# EAGLE schematic Dist_board_(1.21) (EAGLE 7.5.0)
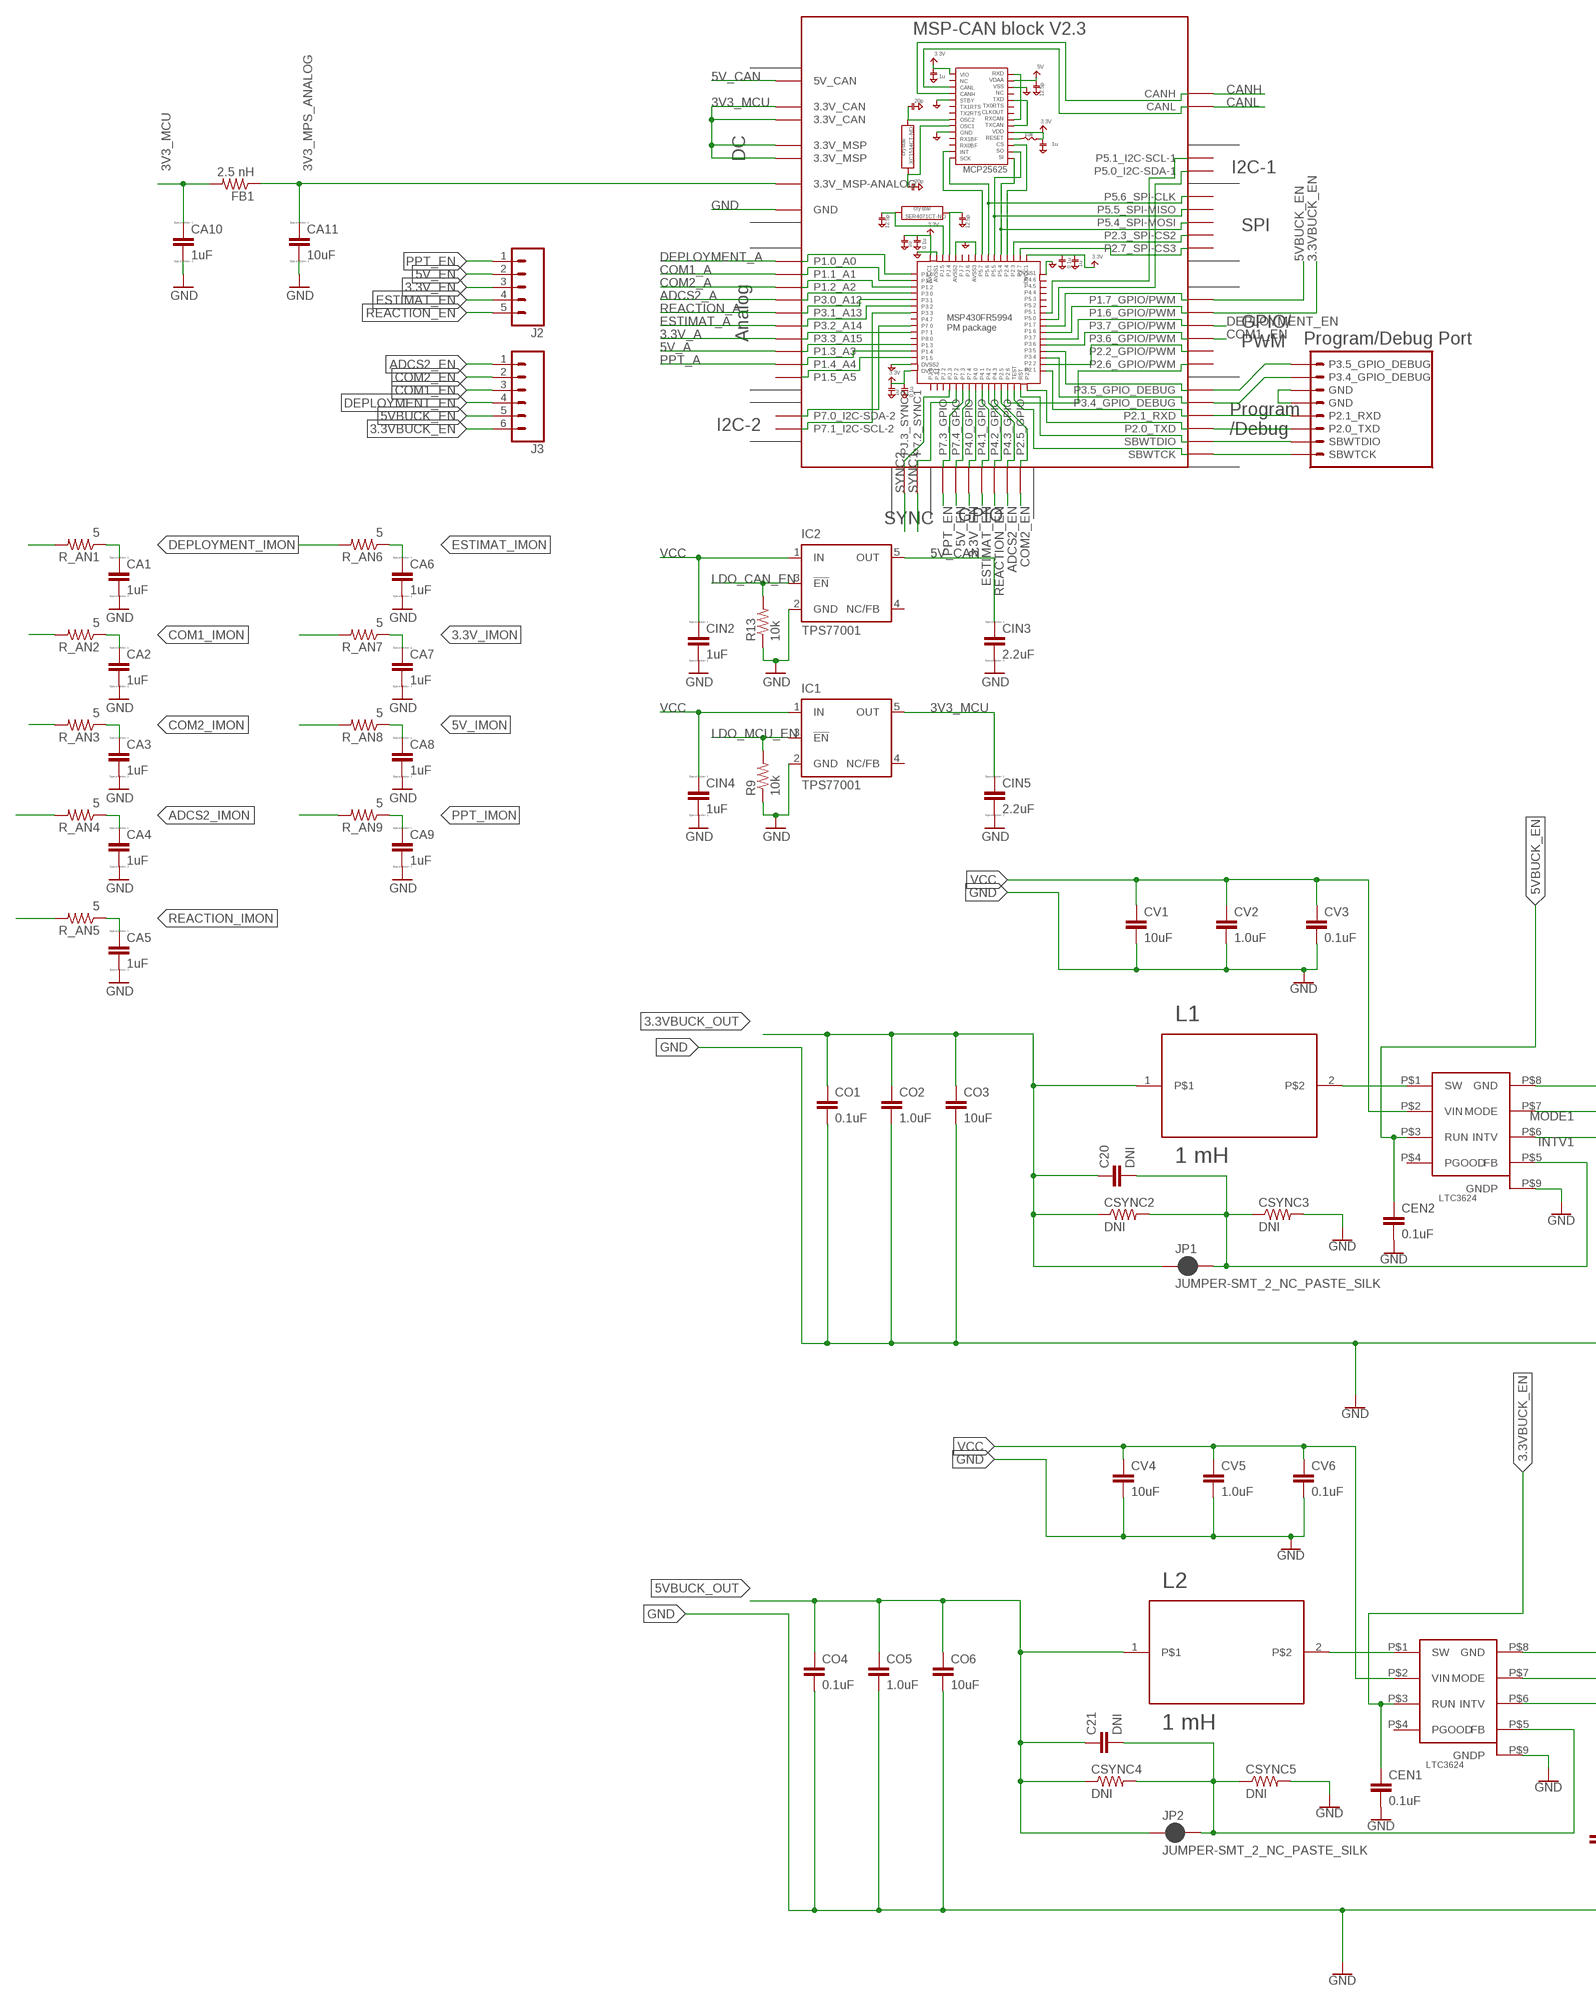
[diagram p0: schematic, sheet 1, part 1 of 3]
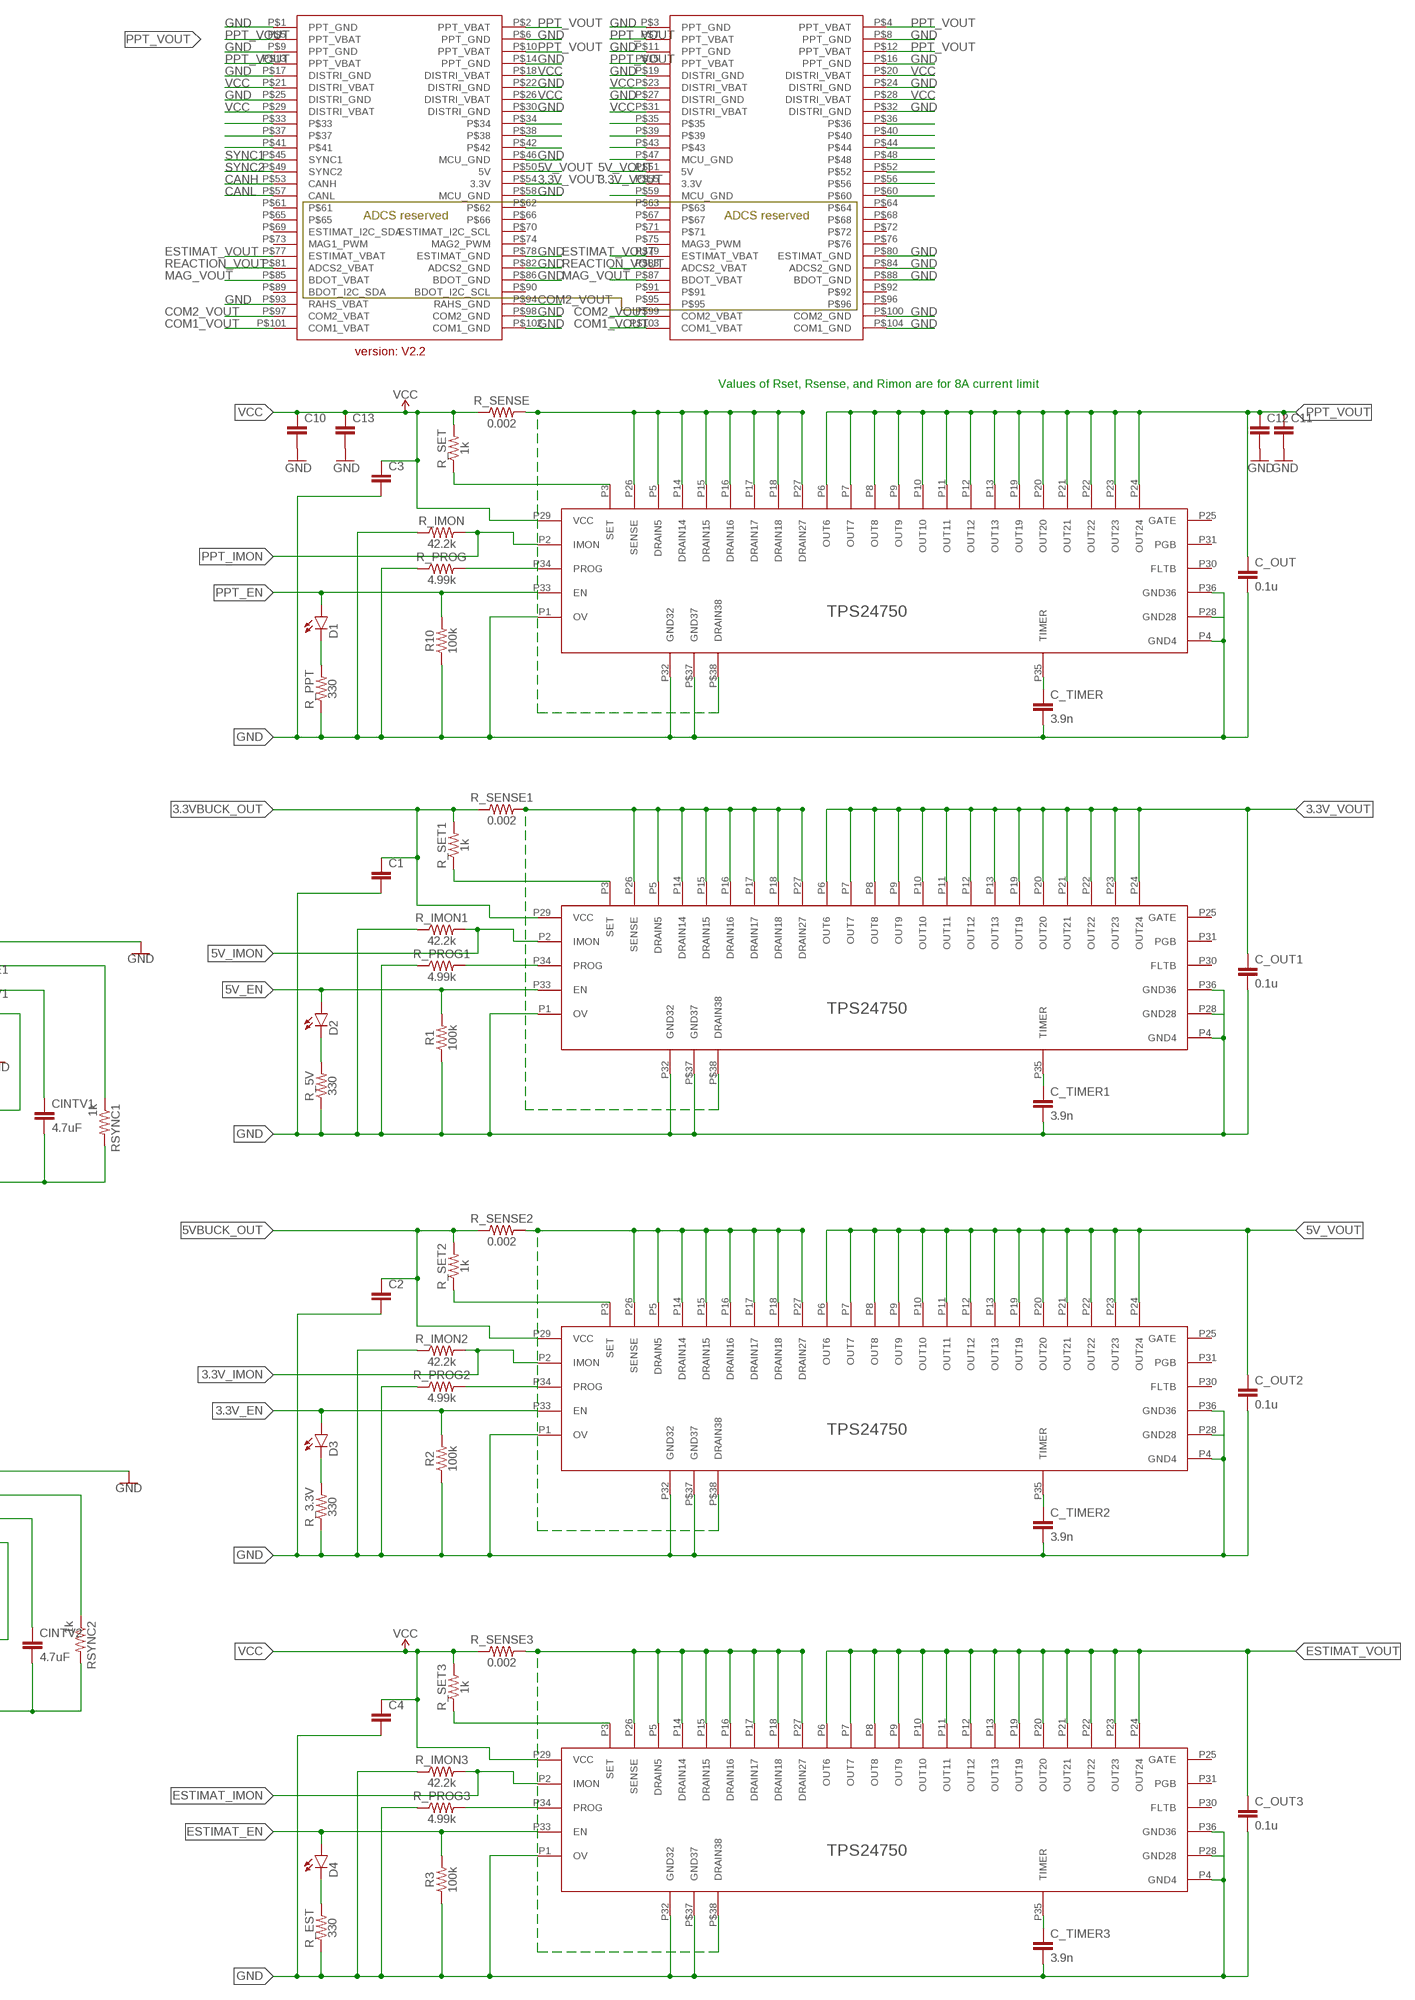
[diagram p1: schematic, sheet 1, part 2 of 3]
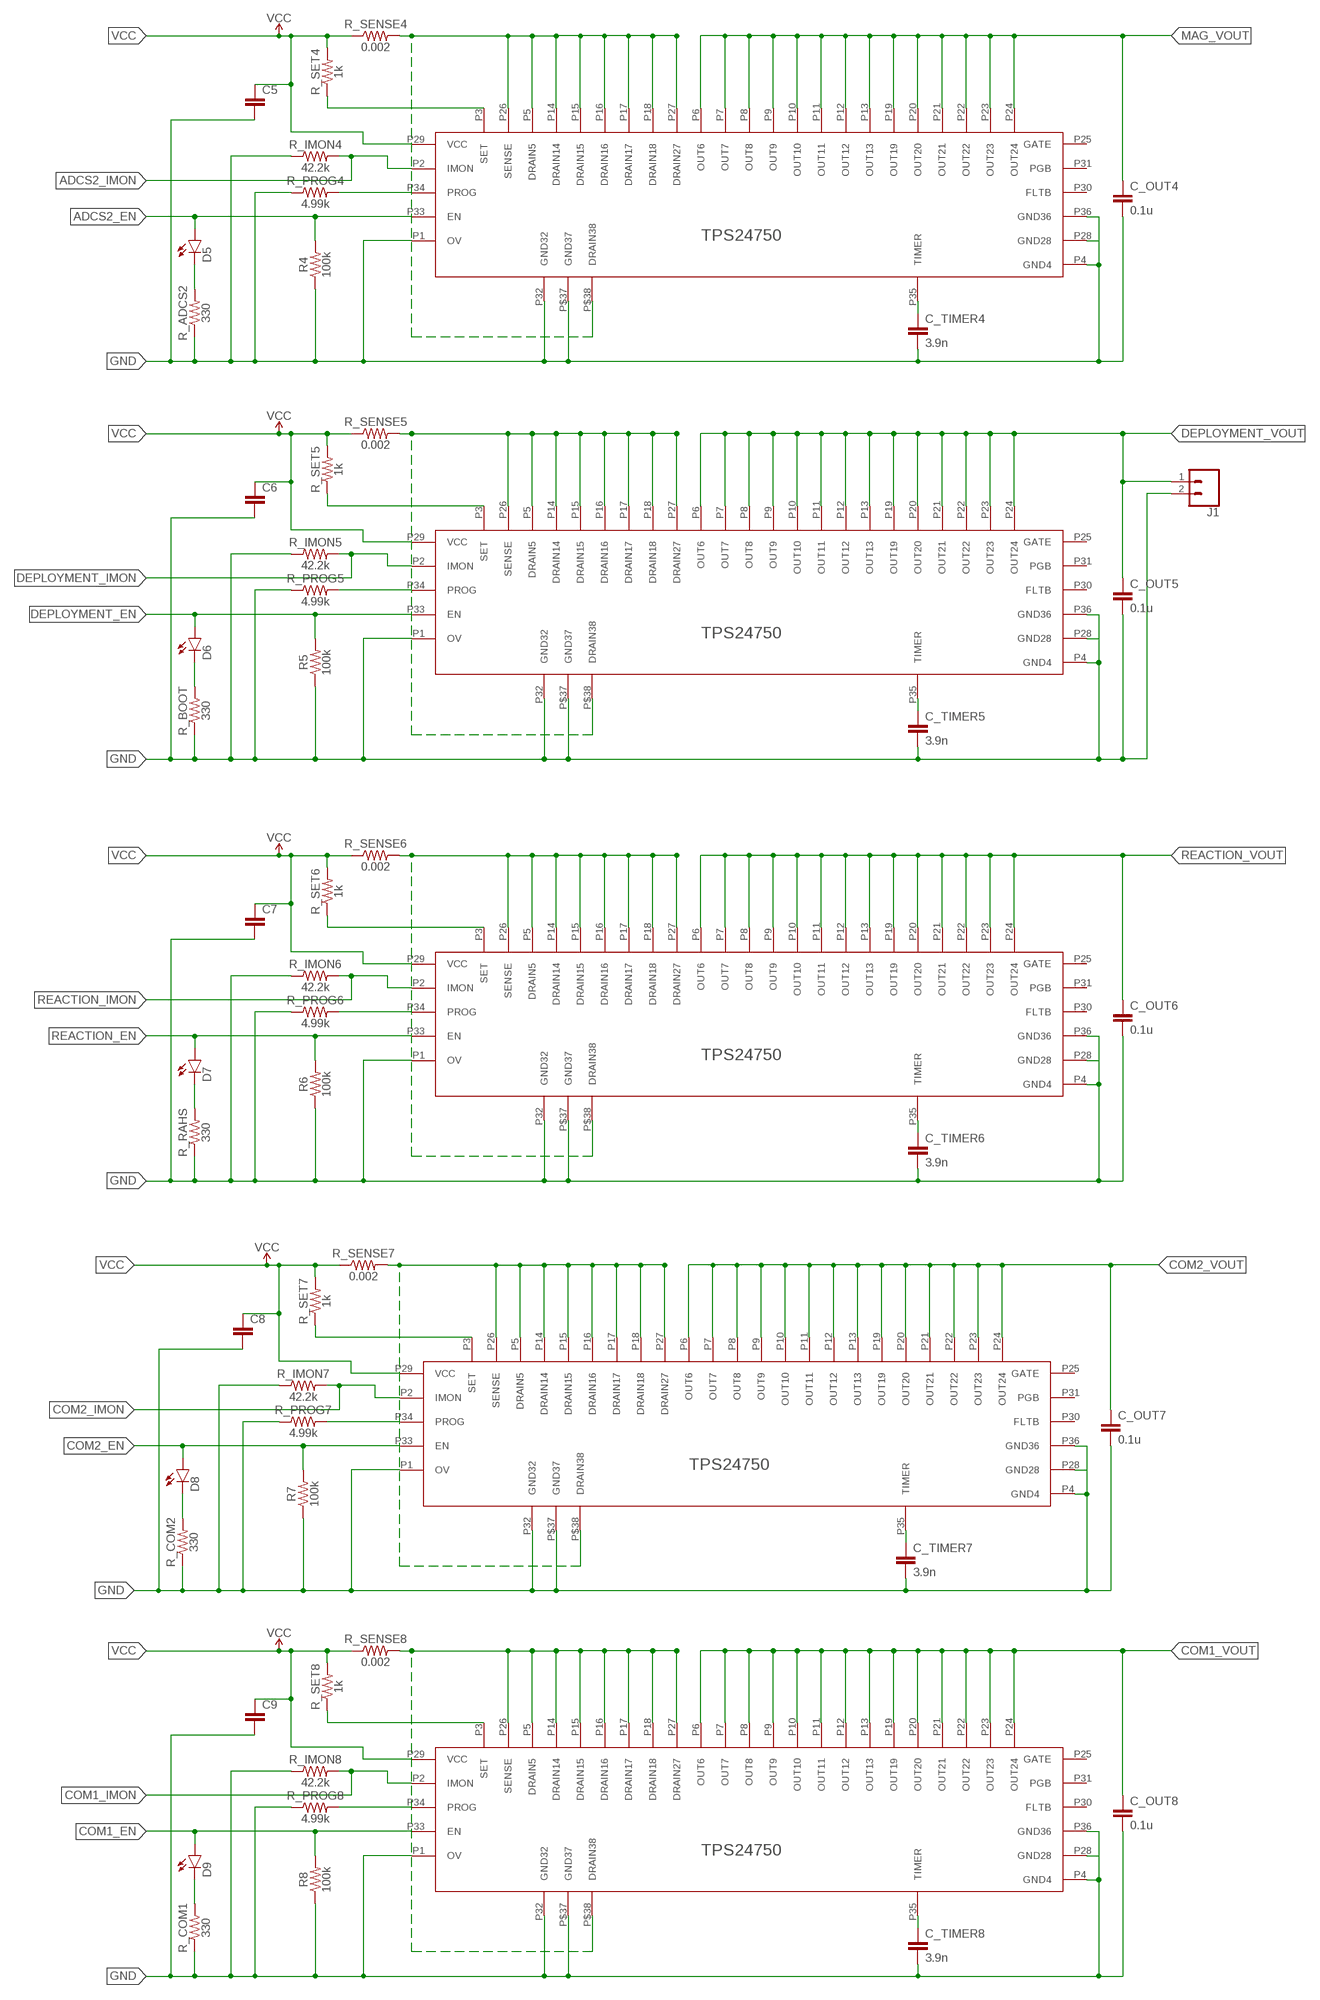
[diagram p2: schematic, sheet 1, part 3 of 3]

## Parts
C1  GEN_CAP_0805SMD  [0805]
C2  GEN_CAP_0805SMD  [0805]
C3  GEN_CAP_0805SMD  [0805]
C4  GEN_CAP_0805SMD  [0805]
C5  GEN_CAP_0805SMD  [0805]
C6  GEN_CAP_0805SMD  [0805]
C7  GEN_CAP_0805SMD  [0805]
C8  GEN_CAP_0805SMD  [0805]
C9  GEN_CAP_0805SMD  [0805]
C10  GEN_CAP_0805SMD  [0805]
C11  GEN_CAP_0805SMD  [0805]
C12  GEN_CAP_0805SMD  [0805]
C13  GEN_CAP_0805SMD  [0805]
C20  DNI  1.0UF-0805-25V-(+80/-20%)  [0805]
C21  DNI  1.0UF-0805-25V-(+80/-20%)  [0805]
C_OUT  0.1u  GEN_CAP_0805SMD  [0805]
C_OUT1  0.1u  GEN_CAP_0805SMD  [0805]
C_OUT2  0.1u  GEN_CAP_0805SMD  [0805]
C_OUT3  0.1u  GEN_CAP_0805SMD  [0805]
C_OUT4  0.1u  GEN_CAP_0805SMD  [0805]
C_OUT5  0.1u  GEN_CAP_0805SMD  [0805]
C_OUT6  0.1u  GEN_CAP_0805SMD  [0805]
C_OUT7  0.1u  GEN_CAP_0805SMD  [0805]
C_OUT8  0.1u  GEN_CAP_0805SMD  [0805]
C_TIMER  3.9n  GEN_CAP_0805SMD  [0805]
C_TIMER1  3.9n  GEN_CAP_0805SMD  [0805]
C_TIMER2  3.9n  GEN_CAP_0805SMD  [0805]
C_TIMER3  3.9n  GEN_CAP_0805SMD  [0805]
C_TIMER4  3.9n  GEN_CAP_0805SMD  [0805]
C_TIMER5  3.9n  GEN_CAP_0805SMD  [0805]
C_TIMER6  3.9n  GEN_CAP_0805SMD  [0805]
C_TIMER7  3.9n  GEN_CAP_0805SMD  [0805]
C_TIMER8  3.9n  GEN_CAP_0805SMD  [0805]
CA1  1uF  C  [C0805]
CA2  1uF  C  [C0805]
CA3  1uF  C  [C0805]
CA4  1uF  C  [C0805]
CA5  1uF  C  [C0805]
CA6  1uF  C  [C0805]
CA7  1uF  C  [C0805]
CA8  1uF  C  [C0805]
CA9  1uF  C  [C0805]
CA10  1uF  C  [C0805]
CA11  10uF  C  [C0805]
CEN1  0.1uF  2.2UF-0805-25V-(+80/-20%)  [0805]
CEN2  0.1uF  2.2UF-0805-25V-(+80/-20%)  [0805]
CIN2  1uF  C  [C0805]
CIN3  2.2uF  C  [C0805]
CIN4  1uF  C  [C0805]
CIN5  2.2uF  C  [C0805]
CINTV1  4.7uF  2.2UF-0805-25V-(+80/-20%)  [0805]
CINTV2  4.7uF  2.2UF-0805-25V-(+80/-20%)  [0805]
CO1  0.1uF  1.0UF-0805-25V-(+80/-20%)  [0805]
CO2  1.0uF  1.0UF-0805-25V-(+80/-20%)  [0805]
CO3  10uF  10UF-0805-10V-10%  [0805]
CO4  0.1uF  1.0UF-0805-25V-(+80/-20%)  [0805]
CO5  1.0uF  1.0UF-0805-25V-(+80/-20%)  [0805]
CO6  10uF  10UF-0805-10V-10%  [0805]
CSYNC2  DNI  R-US_R0805  [R0805]
CSYNC3  DNI  R-US_R0805  [R0805]
CSYNC4  DNI  R-US_R0805  [R0805]
CSYNC5  DNI  R-US_R0805  [R0805]
CV1  10uF  1.0UF-0805-25V-10%  [0805]
CV2  1.0uF  1.0UF-0805-25V-10%  [0805]
CV3  0.1uF  1.0UF-0805-25V-10%  [0805]
CV4  10uF  1.0UF-0805-25V-10%  [0805]
CV5  1.0uF  1.0UF-0805-25V-10%  [0805]
CV6  0.1uF  1.0UF-0805-25V-10%  [0805]
D1  LED  [LED-1206]
D2  LED  [LED-1206]
D3  LED  [LED-1206]
D4  LED  [LED-1206]
D5  LED  [LED-1206]
D6  LED  [LED-1206]
D7  LED  [LED-1206]
D8  LED  [LED-1206]
D9  LED  [LED-1206]
FB1  2.5 nH  R-US_R0805  [R0805]
IC1  TPS77001  [SOT23-DBV]
IC2  TPS77001  [SOT23-DBV]
J1  CONN_023.5MM  [SCREWTERMINAL-3.5MM-2]
J2  CONN_05LOCK  [1X05_LOCK]
J3  CONN_06LOCK  [1X06_LOCK]
JP1  JUMPER-SMT_2_NC_PASTE_SILK  [SMT-JUMPER_2_NC_PASTE_SILK]
JP2  JUMPER-SMT_2_NC_PASTE_SILK  [SMT-JUMPER_2_NC_PASTE_SILK]
L1  1 mH  XAL4030-332ME  [COILCRAFT]
L2  1 mH  XAL4030-332ME  [COILCRAFT]
R1  100k  GEN_RES_0805SMD  [0805]
R2  100k  GEN_RES_0805SMD  [0805]
R3  100k  GEN_RES_0805SMD  [0805]
R4  100k  GEN_RES_0805SMD  [0805]
R5  100k  GEN_RES_0805SMD  [0805]
R6  100k  GEN_RES_0805SMD  [0805]
R7  100k  GEN_RES_0805SMD  [0805]
R8  100k  GEN_RES_0805SMD  [0805]
R9  10k  R-US_R0805  [R0805]
R10  100k  GEN_RES_0805SMD  [0805]
R13  10k  R-US_R0805  [R0805]
R_3.3V  330  GEN_RES_0805SMD  [0805]
R_5V  330  GEN_RES_0805SMD  [0805]
R_ADCS2  330  GEN_RES_0805SMD  [0805]
R_AN1  5  R-US_R0805  [R0805]
R_AN2  5  R-US_R0805  [R0805]
R_AN3  5  R-US_R0805  [R0805]
R_AN4  5  R-US_R0805  [R0805]
R_AN5  5  R-US_R0805  [R0805]
R_AN6  5  R-US_R0805  [R0805]
R_AN7  5  R-US_R0805  [R0805]
R_AN8  5  R-US_R0805  [R0805]
R_AN9  5  R-US_R0805  [R0805]
R_BOOT  330  GEN_RES_0805SMD  [0805]
R_COM1  330  GEN_RES_0805SMD  [0805]
R_COM2  330  GEN_RES_0805SMD  [0805]
R_EST  330  GEN_RES_0805SMD  [0805]
R_IMON  42.2k  GEN_RES_0805SMD  [0805]
R_IMON1  42.2k  GEN_RES_0805SMD  [0805]
R_IMON2  42.2k  GEN_RES_0805SMD  [0805]
R_IMON3  42.2k  GEN_RES_0805SMD  [0805]
R_IMON4  42.2k  GEN_RES_0805SMD  [0805]
R_IMON5  42.2k  GEN_RES_0805SMD  [0805]
R_IMON6  42.2k  GEN_RES_0805SMD  [0805]
R_IMON7  42.2k  GEN_RES_0805SMD  [0805]
R_IMON8  42.2k  GEN_RES_0805SMD  [0805]
R_PPT  330  GEN_RES_0805SMD  [0805]
R_PROG  4.99k  GEN_RES_0805SMD  [0805]
R_PROG1  4.99k  GEN_RES_0805SMD  [0805]
R_PROG2  4.99k  GEN_RES_0805SMD  [0805]
R_PROG3  4.99k  GEN_RES_0805SMD  [0805]
R_PROG4  4.99k  GEN_RES_0805SMD  [0805]
R_PROG5  4.99k  GEN_RES_0805SMD  [0805]
R_PROG6  4.99k  GEN_RES_0805SMD  [0805]
R_PROG7  4.99k  GEN_RES_0805SMD  [0805]
R_PROG8  4.99k  GEN_RES_0805SMD  [0805]
R_RAHS  330  GEN_RES_0805SMD  [0805]
R_SENSE  0.002  GEN_RES_2010SMD  [2010]
R_SENSE1  0.002  GEN_RES_2010SMD  [2010]
R_SENSE2  0.002  GEN_RES_2010SMD  [2010]
R_SENSE3  0.002  GEN_RES_2010SMD  [2010]
R_SENSE4  0.002  GEN_RES_2010SMD  [2010]
R_SENSE5  0.002  GEN_RES_2010SMD  [2010]
R_SENSE6  0.002  GEN_RES_2010SMD  [2010]
R_SENSE7  0.002  GEN_RES_2010SMD  [2010]
R_SENSE8  0.002  GEN_RES_2010SMD  [2010]
R_SET  1k  GEN_RES_0805SMD  [0805]
R_SET1  1k  GEN_RES_0805SMD  [0805]
R_SET2  1k  GEN_RES_0805SMD  [0805]
R_SET3  1k  GEN_RES_0805SMD  [0805]
R_SET4  1k  GEN_RES_0805SMD  [0805]
R_SET5  1k  GEN_RES_0805SMD  [0805]
R_SET6  1k  GEN_RES_0805SMD  [0805]
R_SET7  1k  GEN_RES_0805SMD  [0805]
R_SET8  1k  GEN_RES_0805SMD  [0805]
RSYNC1  1k  R-US_R0805  [R0805]
RSYNC2  1k  R-US_R0805  [R0805]
U$1  TI_SWITCH_TPS24750  [QFN-36]
U$2  PC104_CONNECTOR  [PC104_CONNECTOR]
U$5  TI_SWITCH_TPS24750  [QFN-36]
U$6  TI_SWITCH_TPS24750  [QFN-36]
U$7  TI_SWITCH_TPS24750  [QFN-36]
U$8  TI_SWITCH_TPS24750  [QFN-36]
U$9  TI_SWITCH_TPS24750  [QFN-36]
U$10  TI_SWITCH_TPS24750  [QFN-36]
U$11  TI_SWITCH_TPS24750  [QFN-36]
U$12  TI_SWITCH_TPS24750  [QFN-36]
U$13  LINEAR_BUCK_LTC3624  [8-LFCSP]
U$14  LINEAR_BUCK_LTC3624  [8-LFCSP]
U$15  MSP-CAN_BLOCK  [MSP-CAN_BLOCK]
U$16  PROGRAM/DEBUG_PORT  [1X08_CONNECTOR]

## Nets
3.3V_A: CA7.1 R_AN7.1 U$15.P3.3_A15
3.3V_EN: D3.A J2.3 R2.2 U$6.P33(EN) U$15.P4.0_GPIO
3.3V_IMON: R_AN7.2 R_IMON2.2 U$6.P2(IMON)
3.3V_VOUT: C_OUT1.1 U$2.P$54(3.3V) U$2.P$55(3.3V) U$5.P6(OUT6) U$5.P7(OUT7) U$5.P8(OUT8) U$5.P9(OUT9) U$5.P10(OUT10) U$5.P11(OUT11) U$5.P12(OUT12) U$5.P13(OUT13) U$5.P19(OUT19) U$5.P20(OUT20) U$5.P21(OUT21) U$5.P22(OUT22) U$5.P23(OUT23) U$5.P24(OUT24)
3.3VBUCK_EN: CEN1.1 J3.6 U$14.P$3(RUN) U$15.P1.6_GPIO/PWM
3.3VBUCK_OUT: C1.1 C20.1 CO1.1 CO2.1 CO3.1 CSYNC2.1 JP1.1 L1.1 R_SENSE1.1 R_SET1.2 U$5.P29(VCC)
3V3_MCU: CA10.1 CIN5.1 FB1.2 IC1.5(OUT) U$15.3.3V@CAN1(3.3V_CAN) U$15.3.3V@CAN2(3.3V_CAN) U$15.3.3V@MSP1(3.3V_MSP) U$15.3.3V@MSP2(3.3V_MSP)
3V3_MPS_ANALOG: CA11.1 FB1.1 U$15.3.3V_ANALOG@MSP2(3.3V_MSP-ANALOG)
5V_A: CA8.1 R_AN8.1 U$15.P1.3_A3
5V_CAN: CIN3.1 IC2.5(OUT) U$15.5V(5V_CAN)
5V_EN: D2.A J2.2 R1.2 U$5.P33(EN) U$15.P7.4_GPIO
5V_IMON: R_AN8.2 R_IMON1.2 U$5.P2(IMON)
5V_VOUT: C_OUT2.1 U$2.P$50(5V) U$2.P$51(5V) U$6.P6(OUT6) U$6.P7(OUT7) U$6.P8(OUT8) U$6.P9(OUT9) U$6.P10(OUT10) U$6.P11(OUT11) U$6.P12(OUT12) U$6.P13(OUT13) U$6.P19(OUT19) U$6.P20(OUT20) U$6.P21(OUT21) U$6.P22(OUT22) U$6.P23(OUT23) U$6.P24(OUT24)
5VBUCK_EN: CEN2.1 J3.5 U$13.P$3(RUN) U$15.P1.7_GPIO/PWM
5VBUCK_OUT: C2.1 C21.1 CO4.1 CO5.1 CO6.1 CSYNC4.1 JP2.1 L2.1 R_SENSE2.1 R_SET2.2 U$6.P29(VCC)
ADCS2_A: CA4.1 R_AN4.1 U$15.P3.0_A12
ADCS2_EN: D5.A J3.1 R4.2 U$8.P33(EN) U$15.P4.3_GPIO
ADCS2_IMON: R_AN4.2 R_IMON4.2 U$8.P2(IMON)
CAN_FB: C20.2 CSYNC2.2 CSYNC3.1 JP1.2 U$13.P$5(FB)
CANH: U$2.P$53(CANH) U$15.CANH
CANL: U$2.P$57(CANL) U$15.CANL
COM1_A: CA2.1 R_AN2.1 U$15.P1.1_A1
COM1_EN: D9.A J3.3 R8.2 U$12.P33(EN) U$15.P3.6_GPIO/PWM
COM1_IMON: R_AN2.2 R_IMON8.2 U$12.P2(IMON)
COM1_VOUT: C_OUT8.1 U$2.P$101(COM1_VBAT) U$2.P$103(COM1_VBAT) U$12.P6(OUT6) U$12.P7(OUT7) U$12.P8(OUT8) U$12.P9(OUT9) U$12.P10(OUT10) U$12.P11(OUT11) U$12.P12(OUT12) U$12.P13(OUT13) U$12.P19(OUT19) U$12.P20(OUT20) U$12.P21(OUT21) U$12.P22(OUT22) U$12.P23(OUT23) U$12.P24(OUT24)
COM2_A: CA3.1 R_AN3.1 U$15.P1.2_A2
COM2_EN: D8.A J3.2 R7.2 U$11.P33(EN) U$15.P2.5_GPIO
COM2_IMON: R_AN3.2 R_IMON7.2 U$11.P2(IMON)
COM2_VOUT: C_OUT7.1 U$2.P$94(RAHS_GND) U$2.P$97(COM2_VBAT) U$2.P$99(COM2_VBAT) U$11.P6(OUT6) U$11.P7(OUT7) U$11.P8(OUT8) U$11.P9(OUT9) U$11.P10(OUT10) U$11.P11(OUT11) U$11.P12(OUT12) U$11.P13(OUT13) U$11.P19(OUT19) U$11.P20(OUT20) U$11.P21(OUT21) U$11.P22(OUT22) U$11.P23(OUT23) U$11.P24(OUT24)
DEPLOYMENT_A: CA1.1 R_AN1.1 U$15.P1.0_A0
DEPLOYMENT_EN: D6.A J3.4 R5.2 U$9.P33(EN) U$15.P3.7_GPIO/PWM
DEPLOYMENT_IMON: R_AN1.2 R_IMON5.2 U$9.P2(IMON)
DEPLOYMENT_VOUT: C_OUT5.1 J1.1 U$9.P6(OUT6) U$9.P7(OUT7) U$9.P8(OUT8) U$9.P9(OUT9) U$9.P10(OUT10) U$9.P11(OUT11) U$9.P12(OUT12) U$9.P13(OUT13) U$9.P19(OUT19) U$9.P20(OUT20) U$9.P21(OUT21) U$9.P22(OUT22) U$9.P23(OUT23) U$9.P24(OUT24)
DRAIN: R_SENSE.2 U$1.P5(DRAIN5) U$1.P14(DRAIN14) U$1.P15(DRAIN15) U$1.P16(DRAIN16) U$1.P17(DRAIN17) U$1.P18(DRAIN18) U$1.P26(SENSE) U$1.P27(DRAIN27) U$1.P$38(DRAIN38)
DRAIN1: R_SENSE1.2 U$5.P5(DRAIN5) U$5.P14(DRAIN14) U$5.P15(DRAIN15) U$5.P16(DRAIN16) U$5.P17(DRAIN17) U$5.P18(DRAIN18) U$5.P26(SENSE) U$5.P27(DRAIN27) U$5.P$38(DRAIN38)
DRAIN2: R_SENSE2.2 U$6.P5(DRAIN5) U$6.P14(DRAIN14) U$6.P15(DRAIN15) U$6.P16(DRAIN16) U$6.P17(DRAIN17) U$6.P18(DRAIN18) U$6.P26(SENSE) U$6.P27(DRAIN27) U$6.P$38(DRAIN38)
DRAIN3: R_SENSE3.2 U$7.P5(DRAIN5) U$7.P14(DRAIN14) U$7.P15(DRAIN15) U$7.P16(DRAIN16) U$7.P17(DRAIN17) U$7.P18(DRAIN18) U$7.P26(SENSE) U$7.P27(DRAIN27) U$7.P$38(DRAIN38)
DRAIN4: R_SENSE4.2 U$8.P5(DRAIN5) U$8.P14(DRAIN14) U$8.P15(DRAIN15) U$8.P16(DRAIN16) U$8.P17(DRAIN17) U$8.P18(DRAIN18) U$8.P26(SENSE) U$8.P27(DRAIN27) U$8.P$38(DRAIN38)
DRAIN5: R_SENSE5.2 U$9.P5(DRAIN5) U$9.P14(DRAIN14) U$9.P15(DRAIN15) U$9.P16(DRAIN16) U$9.P17(DRAIN17) U$9.P18(DRAIN18) U$9.P26(SENSE) U$9.P27(DRAIN27) U$9.P$38(DRAIN38)
DRAIN6: R_SENSE6.2 U$10.P5(DRAIN5) U$10.P14(DRAIN14) U$10.P15(DRAIN15) U$10.P16(DRAIN16) U$10.P17(DRAIN17) U$10.P18(DRAIN18) U$10.P26(SENSE) U$10.P27(DRAIN27) U$10.P$38(DRAIN38)
DRAIN7: R_SENSE7.2 U$11.P5(DRAIN5) U$11.P14(DRAIN14) U$11.P15(DRAIN15) U$11.P16(DRAIN16) U$11.P17(DRAIN17) U$11.P18(DRAIN18) U$11.P26(SENSE) U$11.P27(DRAIN27) U$11.P$38(DRAIN38)
DRAIN8: R_SENSE8.2 U$12.P5(DRAIN5) U$12.P14(DRAIN14) U$12.P15(DRAIN15) U$12.P16(DRAIN16) U$12.P17(DRAIN17) U$12.P18(DRAIN18) U$12.P26(SENSE) U$12.P27(DRAIN27) U$12.P$38(DRAIN38)
ESTIMAT_A: CA6.1 R_AN6.1 U$15.P3.2_A14
ESTIMAT_EN: D4.A J2.4 R3.2 U$7.P33(EN) U$15.P4.1_GPIO
ESTIMAT_IMON: R_AN6.2 R_IMON3.2 U$7.P2(IMON)
ESTIMAT_VOUT: C_OUT3.1 U$2.P$77(ESTIMAT_VBAT) U$2.P$79(ESTIMAT_VBAT) U$7.P6(OUT6) U$7.P7(OUT7) U$7.P8(OUT8) U$7.P9(OUT9) U$7.P10(OUT10) U$7.P11(OUT11) U$7.P12(OUT12) U$7.P13(OUT13) U$7.P19(OUT19) U$7.P20(OUT20) U$7.P21(OUT21) U$7.P22(OUT22) U$7.P23(OUT23) U$7.P24(OUT24)
GND: C1.2 C2.2 C3.2 C4.2 C5.2 C6.2 C7.2 C8.2 C9.2 C10.2 C11.2 C12.2 C13.2 C_OUT1.2 C_OUT2.2 C_OUT3.2 C_OUT4.2 C_OUT5.2 C_OUT6.2 C_OUT7.2 C_OUT8.2 C_OUT.2 C_TIMER1.2 C_TIMER2.2 C_TIMER3.2 C_TIMER4.2 C_TIMER5.2 C_TIMER6.2 C_TIMER7.2 C_TIMER8.2 C_TIMER.2 CA1.2 CA2.2 CA3.2 CA4.2 CA5.2 CA6.2 CA7.2 CA8.2 CA9.2 CA10.2 CA11.2 CEN1.2 CEN2.2 CIN2.2 CIN3.2 CIN4.2 CIN5.2 CINTV1.2 CINTV2.2 CO1.2 CO2.2 CO3.2 CO4.2 CO5.2 CO6.2 CSYNC3.2 CSYNC5.2 CV1.2 CV2.2 CV3.2 CV4.2 CV5.2 CV6.2 IC1.2(GND) IC2.2(GND) J1.2 R1.1 R2.1 R3.1 R4.1 R5.1 R6.1 R7.1 R8.1 R9.1 R10.1 R13.1 R_3.3V.1 R_5V.1 R_ADCS2.1 R_BOOT.1 R_COM1.1 R_COM2.1 R_EST.1 R_IMON1.1 R_IMON2.1 R_IMON3.1 R_IMON4.1 R_IMON5.1 R_IMON6.1 R_IMON7.1 R_IMON8.1 R_IMON.1 R_PPT.1 R_PROG1.1 R_PROG2.1 R_PROG3.1 R_PROG4.1 R_PROG5.1 R_PROG6.1 R_PROG7.1 R_PROG8.1 R_PROG.1 R_RAHS.1 RSYNC1.2 RSYNC2.2 U$1.P1(OV) U$1.P4(GND4) U$1.P28(GND28) U$1.P32(GND32) U$1.P36(GND36) U$1.P$37(GND37) U$2.P$1(PPT_GND) U$2.P$3(PPT_GND) U$2.P$6(PPT_GND) U$2.P$8(PPT_GND) U$2.P$9(PPT_GND) U$2.P$11(PPT_GND) U$2.P$14(PPT_GND) U$2.P$16(PPT_GND) U$2.P$17(DISTRI_GND) U$2.P$19(DISTRI_GND) U$2.P$22(DISTRI_GND) U$2.P$24(DISTRI_GND) U$2.P$25(DISTRI_GND) U$2.P$27(DISTRI_GND) U$2.P$30(DISTRI_GND) U$2.P$32(DISTRI_GND) U$2.P$46(MCU_GND) U$2.P$47(MCU_GND) U$2.P$58(MCU_GND) U$2.P$59(MCU_GND) U$2.P$78(ESTIMAT_GND) U$2.P$80(ESTIMAT_GND) U$2.P$82(ADCS2_GND) U$2.P$84(ADCS2_GND) U$2.P$86(BDOT_GND) U$2.P$88(BDOT_GND) U$2.P$93(RAHS_VBAT) U$2.P$98(COM2_GND) U$2.P$100(COM2_GND) U$2.P$102(COM1_GND) U$2.P$104(COM1_GND) U$5.P1(OV) U$5.P4(GND4) U$5.P28(GND28) U$5.P32(GND32) U$5.P36(GND36) U$5.P$37(GND37) U$6.P1(OV) U$6.P4(GND4) U$6.P28(GND28) U$6.P32(GND32) U$6.P36(GND36) U$6.P$37(GND37) U$7.P1(OV) U$7.P4(GND4) U$7.P28(GND28) U$7.P32(GND32) U$7.P36(GND36) U$7.P$37(GND37) U$8.P1(OV) U$8.P4(GND4) U$8.P28(GND28) U$8.P32(GND32) U$8.P36(GND36) U$8.P$37(GND37) U$9.P1(OV) U$9.P4(GND4) U$9.P28(GND28) U$9.P32(GND32) U$9.P36(GND36) U$9.P$37(GND37) U$10.P1(OV) U$10.P4(GND4) U$10.P28(GND28) U$10.P32(GND32) U$10.P36(GND36) U$10.P$37(GND37) U$11.P1(OV) U$11.P4(GND4) U$11.P28(GND28) U$11.P32(GND32) U$11.P36(GND36) U$11.P$37(GND37) U$12.P1(OV) U$12.P4(GND4) U$12.P28(GND28) U$12.P32(GND32) U$12.P36(GND36) U$12.P$37(GND37) U$13.P$8(GND) U$13.P$9(GNDP) U$14.P$8(GND) U$14.P$9(GNDP) U$15.GND@1(GND) U$15.GND@2(GND) U$15.GND@3(GND) U$15.GND@4(GND) U$15.GND@5(GND) U$15.GND@7(GND) U$15.GND@8(GND) U$15.GND@9(GND) U$15.GND@10(GND) U$15.GND@11(GND) U$15.GND@12(GND) U$15.GND@13(GND) U$15.GND@14(GND) U$15.GND@15(GND) U$15.GND@16(GND) U$15.GND@17(GND) U$15.GND@26(GND) U$16.5(GND) U$16.6(GND)
INTV1: CINTV1.1 U$13.P$6(INTV)
INTV2: CINTV2.1 U$14.P$6(INTV)
LDO_CAN_EN: IC2.3(!EN) R13.2
LDO_MCU_EN: IC1.3(!EN) R9.2
MAG_VOUT: C_OUT4.1 U$2.P$85(BDOT_VBAT) U$2.P$87(BDOT_VBAT) U$8.P6(OUT6) U$8.P7(OUT7) U$8.P8(OUT8) U$8.P9(OUT9) U$8.P10(OUT10) U$8.P11(OUT11) U$8.P12(OUT12) U$8.P13(OUT13) U$8.P19(OUT19) U$8.P20(OUT20) U$8.P21(OUT21) U$8.P22(OUT22) U$8.P23(OUT23) U$8.P24(OUT24)
MCU_FB: C21.2 CSYNC4.2 CSYNC5.1 JP2.2 U$14.P$5(FB)
MODE1: RSYNC1.1 U$13.P$7(MODE)
MODE2: RSYNC2.1 U$14.P$7(MODE)
N$20: U$2.P$33
N$21: U$2.P$37
N$22: U$2.P$41
N$37: D1.C R_PPT.2
N$38: D2.C R_5V.2
N$39: D3.C R_3.3V.2
N$40: D4.C R_EST.2
N$41: D5.C R_ADCS2.2
N$42: D6.C R_BOOT.2
N$43: D7.C R_RAHS.2
N$44: U$2.P$42
N$45: U$2.P$38
N$46: U$2.P$34
N$47: D8.C R_COM2.2
N$48: D9.C R_COM1.2
N$55: U$2.P$35
N$56: U$2.P$39
N$57: U$2.P$43
N$84: U$2.P$60
N$85: U$2.P$56
N$86: U$2.P$52
N$87: U$2.P$48
N$88: U$2.P$44
N$89: U$2.P$40
N$90: U$2.P$36
P2.0_TXD: U$15.P2.0_TXD U$16.3(P2.0_TXD)
P2.1_RXD: U$15.P2.1_RXD U$16.4(P2.1_RXD)
P3.4_GPIO_DEBUG: U$15.P3.4_GPIO_DEBUG U$16.7(P3.4_GPIO_DEBUG)
P3.5_GPIO_DEBUG: U$15.P3.5_GPIO_DEBUG U$16.8(P3.5_GPIO_DEBUG)
PPT_A: CA9.1 R_AN9.1 U$15.P1.4_A4
PPT_EN: D1.A J2.1 R10.2 U$1.P33(EN) U$15.P7.3_GPIO
PPT_IMON: R_AN9.2 R_IMON.2 U$1.P2(IMON)
PPT_VOUT: C11.1 C12.1 C_OUT.1 U$1.P6(OUT6) U$1.P7(OUT7) U$1.P8(OUT8) U$1.P9(OUT9) U$1.P10(OUT10) U$1.P11(OUT11) U$1.P12(OUT12) U$1.P13(OUT13) U$1.P19(OUT19) U$1.P20(OUT20) U$1.P21(OUT21) U$1.P22(OUT22) U$1.P23(OUT23) U$1.P24(OUT24) U$2.P$2(PPT_VBAT) U$2.P$4(PPT_VBAT) U$2.P$5(PPT_VBAT) U$2.P$7(PPT_VBAT) U$2.P$10(PPT_VBAT) U$2.P$12(PPT_VBAT) U$2.P$13(PPT_VBAT) U$2.P$15(PPT_VBAT)
PROG: R_PROG.2 U$1.P34(PROG)
PROG1: R_PROG1.2 U$5.P34(PROG)
PROG2: R_PROG2.2 U$6.P34(PROG)
PROG3: R_PROG3.2 U$7.P34(PROG)
PROG4: R_PROG4.2 U$8.P34(PROG)
PROG5: R_PROG5.2 U$9.P34(PROG)
PROG6: R_PROG6.2 U$10.P34(PROG)
PROG7: R_PROG7.2 U$11.P34(PROG)
PROG8: R_PROG8.2 U$12.P34(PROG)
REACTION_A: CA5.1 R_AN5.1 U$15.P3.1_A13
REACTION_EN: D7.A J2.5 R6.2 U$10.P33(EN) U$15.P4.2_GPIO
REACTION_IMON: R_AN5.2 R_IMON6.2 U$10.P2(IMON)
REACTION_VOUT: C_OUT6.1 U$2.P$81(ADCS2_VBAT) U$2.P$83(ADCS2_VBAT) U$10.P6(OUT6) U$10.P7(OUT7) U$10.P8(OUT8) U$10.P9(OUT9) U$10.P10(OUT10) U$10.P11(OUT11) U$10.P12(OUT12) U$10.P13(OUT13) U$10.P19(OUT19) U$10.P20(OUT20) U$10.P21(OUT21) U$10.P22(OUT22) U$10.P23(OUT23) U$10.P24(OUT24)
SBWTCK: U$15.SBWTCK U$16.SBWTCK
SBWTDIO: U$15.SBWTDIO U$16.2(SBWTDIO)
SET: R_SET.1 U$1.P3(SET)
SET1: R_SET1.1 U$5.P3(SET)
SET2: R_SET2.1 U$6.P3(SET)
SET3: R_SET3.1 U$7.P3(SET)
SET4: R_SET4.1 U$8.P3(SET)
SET5: R_SET5.1 U$9.P3(SET)
SET6: R_SET6.1 U$10.P3(SET)
SET7: R_SET7.1 U$11.P3(SET)
SET8: R_SET8.1 U$12.P3(SET)
SW: L1.2 U$13.P$1(SW)
SW1: L2.2 U$14.P$1(SW)
SYNC1: U$2.P$45(SYNC1) U$15.P7.2_SYNC1
SYNC2: U$2.P$49(SYNC2) U$15.PJ.3_SYNC2
TIMER: C_TIMER.1 U$1.P35(TIMER)
TIMER1: C_TIMER1.1 U$5.P35(TIMER)
TIMER2: C_TIMER2.1 U$6.P35(TIMER)
TIMER3: C_TIMER3.1 U$7.P35(TIMER)
TIMER4: C_TIMER4.1 U$8.P35(TIMER)
TIMER5: C_TIMER5.1 U$9.P35(TIMER)
TIMER6: C_TIMER6.1 U$10.P35(TIMER)
TIMER7: C_TIMER7.1 U$11.P35(TIMER)
TIMER8: C_TIMER8.1 U$12.P35(TIMER)
VCC: C3.1 C4.1 C5.1 C6.1 C7.1 C8.1 C9.1 C10.1 C13.1 CIN2.1 CIN4.1 CV1.1 CV2.1 CV3.1 CV4.1 CV5.1 CV6.1 IC1.1(IN) IC2.1(IN) R_SENSE3.1 R_SENSE4.1 R_SENSE5.1 R_SENSE6.1 R_SENSE7.1 R_SENSE8.1 R_SENSE.1 R_SET3.2 R_SET4.2 R_SET5.2 R_SET6.2 R_SET7.2 R_SET8.2 R_SET.2 U$1.P29(VCC) U$2.P$18(DISTRI_VBAT) U$2.P$20(DISTRI_VBAT) U$2.P$21(DISTRI_VBAT) U$2.P$23(DISTRI_VBAT) U$2.P$26(DISTRI_VBAT) U$2.P$28(DISTRI_VBAT) U$2.P$29(DISTRI_VBAT) U$2.P$31(DISTRI_VBAT) U$7.P29(VCC) U$8.P29(VCC) U$9.P29(VCC) U$10.P29(VCC) U$11.P29(VCC) U$12.P29(VCC) U$13.P$2(VIN) U$14.P$2(VIN)
Unconnected: IC1.4(NC/FB) IC2.4(NC/FB) U$1.P25(GATE) U$1.P30(FLTB) U$1.P31(PGB) U$2.P$61 U$2.P$62 U$2.P$63 U$2.P$64 U$2.P$65 U$2.P$66 U$2.P$67 U$2.P$68 U$2.P$69(ESTIMAT_I2C_SDA) U$2.P$70(ESTIMAT_I2C_SCL) U$2.P$71 U$2.P$72 U$2.P$73(MAG1_PWM) U$2.P$74(MAG2_PWM) U$2.P$75(MAG3_PWM) U$2.P$76 U$2.P$89(BDOT_I2C_SDA) U$2.P$90(BDOT_I2C_SCL) U$2.P$91 U$2.P$92 U$2.P$95 U$2.P$96 U$5.P25(GATE) U$5.P30(FLTB) U$5.P31(PGB) U$6.P25(GATE) U$6.P30(FLTB) U$6.P31(PGB) U$7.P25(GATE) U$7.P30(FLTB) U$7.P31(PGB) U$8.P25(GATE) U$8.P30(FLTB) U$8.P31(PGB) U$9.P25(GATE) U$9.P30(FLTB) U$9.P31(PGB) U$10.P25(GATE) U$10.P30(FLTB) U$10.P31(PGB) U$11.P25(GATE) U$11.P30(FLTB) U$11.P31(PGB) U$12.P25(GATE) U$12.P30(FLTB) U$12.P31(PGB) U$13.P$4(PGOOD) U$14.P$4(PGOOD) U$15.P1.5_A5 U$15.P2.2_GPIO/PWM U$15.P2.4_SPI-CS2(P2.3_SPI-CS2) U$15.P2.6_GPIO/PWM U$15.P2.7_SPI-CS3 U$15.P5.0_I2C-SDA-1 U$15.P5.1_I2C-SCL-1 U$15.P5.4_SPI-MOSI U$15.P5.5_SPI-MISO U$15.P5.6_SPI-CLK U$15.P7.0_I2C-SDA-2 U$15.P7.1_I2C-SCL-2

## Notes on the sheet
- Values of Rset, Rsense, and Rimon are for 8A current limit

## Library data of the parts
C1-C13 C_OUT C_OUT1-C_OUT8 C_TIMER C_TIMER1-C_TIMER8 = SparkFun-Capacitors:GEN_CAP_0805
C20 C21 CO1 CO4 = SparkFun-Capacitors:1.0UF: 1µF ceramic capacitors A capacitor is a passive two-terminal electrical component used to store electrical energy temporarily in an electric field.; PROD_ID: CAP-11625; VALUE: 1.0uF
CA1-CA11 CIN2-CIN5 = eagle-ltspice:C: CAPACITOR, European symbol; SPICEMODEL: NONE; SPICEPREFIX: C
CEN1 CEN2 CINTV1 CINTV2 = SparkFun-Capacitors:2.2UF: 2.2µF ceramic capacitors A capacitor is a passive two-terminal electrical component used to store electrical energy temporarily in an electric field.; PROD_ID: CAP-11624; VALUE: 2.2uF
CO2 CO5 = SparkFun-Capacitors:1.0UF: 1µF ceramic capacitors A capacitor is a passive two-terminal electrical component used to store electrical energy temporarily in an electric field.; PROD_ID: CAP-11625
CO3 CO6 = SparkFun-Capacitors:10UF: 10.0µF ceramic capacitors A capacitor is a passive two-terminal electrical component used to store electrical energy temporarily in an electric field.; PROD_ID: CAP-11330
CSYNC2-CSYNC5 FB1 R9 R13 R_AN1-R_AN9 RSYNC1 RSYNC2 = rcl:R-US_: RESISTOR, American symbol
CV1 CV3 CV4 CV6 = SparkFun-Capacitors:1.0UF: 1µF ceramic capacitors A capacitor is a passive two-terminal electrical component used to store electrical energy temporarily in an electric field.; PROD_ID: CAP-08064; VALUE: 1.0uF
CV2 CV5 = SparkFun-Capacitors:1.0UF: 1µF ceramic capacitors A capacitor is a passive two-terminal electrical component used to store electrical energy temporarily in an electric field.; PROD_ID: CAP-08064
D1-D9 = CubeSat(V2.4):LED
IC1 IC2 = texas:TPS770*: ULTRALOW-POWER 50-mA LOW-DROPOUT LINEAR REGULATORS 50-mA Low-Dropout Regulator Source: http://focus.ti.com/lit/ds/symlink/tps77001.pdf; MF: TEXAS INSTRUMENTS; MPN: TPS77001DBVT; OC_FARNELL: 8461554; OC_NEWARK: 77C1171
J1 = SparkFun-Connectors:CONN_02: Multi connection point. Often used as Generic Header-pin footprint for 0.1 inch spaced/style header connections On any of the 0.1 inch spaced packages, you can populate with these: Break Away Headers - Straight <https://www.sparkfun.com/products/116> (PRT-00116) Break Away Male Headers - Right Angle <https://www.sparkfun.com/products/553> (PRT-00553) Female Headers <https://www.sparkfun.com/products/115> (PRT-00115) Break Away Headers - Machine Pin <https://www.sparkfun.com/products/117> (PRT-00117) Break Away Female Headers - Swiss Machine Pin <https://www.sparkfun.com/products/743> (PRT-00743) For SCREWTERMINALS and SPRING TERMINALS visit here: Screw Terimnals on SparkFun.com <https://www.sparkfun.com/search/results?term=Screw+Terminals> (5mm/3.5mm/2.54mm spacing) This device is also useful as a general connection point to wire up your design to another part of your project. Our various solder wires solder well into these plated through hole pads. Hook-Up Wire - Assortment (Stranded, 22 AWG) <https://www.sparkfun.com/products/11375> (PRT-11375) Hook-Up Wire - Assortment (Solid Core, 22 AWG) <https://www.sparkfun.com/products/11367> (PRT-11367) View the entire wire category on our website here <https://www.sparkfun.com/categories/141> Special notes: Molex polarized connector foot print use with: PRT-08233 with associated crimp pins and housings. 2.54_SCREWTERM for use with PRT-10571. 3.5mm Screw Terminal footprints for PRT-08084 5mm Screw Terminal footprints for use with PRT-08432; PROD_ID: CONN-08399
J2 = SparkFun-Connectors:CONN_05: Multi connection point. Often used as Generic Header-pin footprint for 0.1 inch spaced/style header connections On any of the 0.1 inch spaced packages, you can populate with these: Break Away Headers - Straight <https://www.sparkfun.com/products/116> (PRT-00116) Break Away Male Headers - Right Angle <https://www.sparkfun.com/products/553> (PRT-00553) Female Headers <https://www.sparkfun.com/products/115> (PRT-00115) Break Away Headers - Machine Pin <https://www.sparkfun.com/products/117> (PRT-00117) Break Away Female Headers - Swiss Machine Pin <https://www.sparkfun.com/products/743> (PRT-00743) For SCREWTERMINALS and SPRING TERMINALS visit here: Screw Terimnals on SparkFun.com <https://www.sparkfun.com/search/results?term=Screw+Terminals> (5mm/3.5mm/2.54mm spacing) This device is also useful as a general connection point to wire up your design to another part of your project. Our various solder wires solder well into these plated through hole pads. Hook-Up Wire - Assortment (Stranded, 22 AWG) <https://www.sparkfun.com/products/11375> (PRT-11375) Hook-Up Wire - Assortment (Solid Core, 22 AWG) <https://www.sparkfun.com/products/11367> (PRT-11367) View the entire wire category on our website here <https://www.sparkfun.com/categories/141> Special notes: Molex polarized connector foot print use with SKU : PRT-08231 with associated crimp pins and housings. 1MM SMD Version SKU: PRT-10208
J3 = SparkFun-Connectors:CONN_06: Multi connection point. Often used as Generic Header-pin footprint for 0.1 inch spaced/style header connections On any of the 0.1 inch spaced packages, you can populate with these: Break Away Headers - Straight <https://www.sparkfun.com/products/116> (PRT-00116) Break Away Male Headers - Right Angle <https://www.sparkfun.com/products/553> (PRT-00553) Female Headers <https://www.sparkfun.com/products/115> (PRT-00115) Break Away Headers - Machine Pin <https://www.sparkfun.com/products/117> (PRT-00117) Break Away Female Headers - Swiss Machine Pin <https://www.sparkfun.com/products/743> (PRT-00743) Arduino Stackable Header - 6 Pin <https://www.sparkfun.com/products/9280> (PRT-09280) For SCREWTERMINALS and SPRING TERMINALS visit here: Screw Terimnals on SparkFun.com <https://www.sparkfun.com/search/results?term=Screw+Terminals> (5mm/3.5mm/2.54mm spacing) This device is also useful as a general connection point to wire up your design to another part of your project. Our various solder wires solder well into these plated through hole pads. Hook-Up Wire - Assortment (Stranded, 22 AWG) <https://www.sparkfun.com/products/11375> (PRT-11375) Hook-Up Wire - Assortment (Solid Core, 22 AWG) <https://www.sparkfun.com/products/11367> (PRT-11367) View the entire wire category on our website here <https://www.sparkfun.com/categories/141>
JP1 JP2 = SparkFun-Jumpers:JUMPER-SMT_2_NC_PASTE: Normally closed solder jumper This jumper has an aperture in the stencil to allow solder paste to bridge the split in the wire so it's normally closed (NC). Wick off the solder to open the connection. Reapply solder to reclose the connection.
L1 L2 = inductors:XAL4030-332ME
R1-R8 R10 R_3.3V R_5V R_ADCS2 R_BOOT R_COM1 R_COM2 R_EST R_IMON R_IMON1-R_IMON8 R_PPT R_PROG R_PROG1-R_PROG8 R_RAHS R_SET R_SET1-R_SET8 = SparkFun-Resistors:GEN_RES_0805: Generic resistor with no value
R_SENSE R_SENSE1-R_SENSE8 = SparkFun-Resistors:GEN_RES_2010
U$1 U$5-U$12 = ICs:TI_SWITCH_TPS24750
U$2 = CubeSat(V2.4):PC104_CONNECTOR
U$13 U$14 = ICs:LINEAR_BUCK_LTC3624
U$15 = CubeSat(V2.4):MSP-CAN_BLOCK
U$16 = CubeSat(V2.4):PROGRAM/DEBUG_PORT